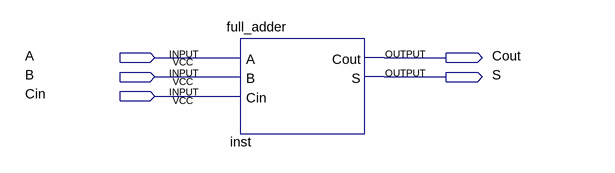
[diagram p0: schematic sheet]
// Quartus schematic topic__2_2.bdf as structural Verilog: 1 symbols, 5 pins
module topic__2_2 (
  input  A,
  input  B,
  input  Cin,
  output Cout,
  output S
);

  full_adder inst (.A(A), .B(B), .Cin(Cin), .Cout(Cout), .S(S));
endmodule
